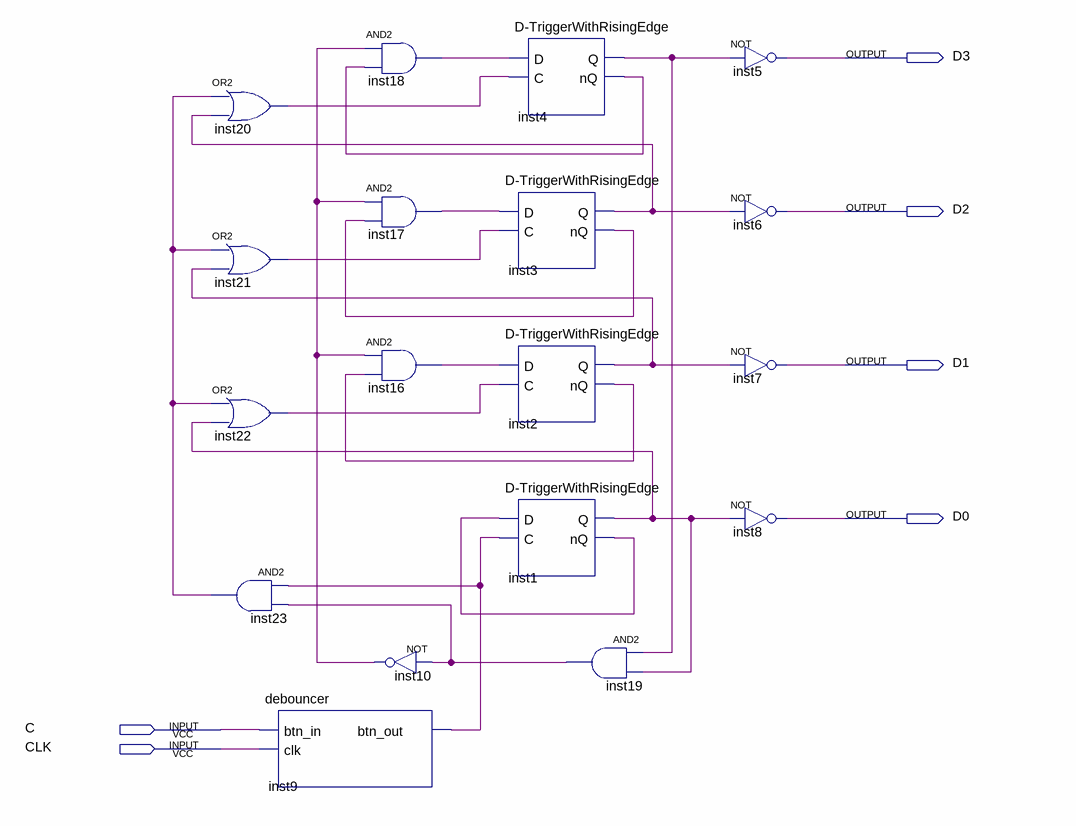
[diagram p0: schematic sheet]
// Quartus schematic Trigger.bdf as structural Verilog: 18 symbols, 6 pins
module Trigger (
  input  C,
  input  CLK,
  output D3,
  output D2,
  output D1,
  output D0
);

  wire inst1_nq, inst1_q, inst2_nq, inst2_q, inst3_nq, inst3_q, inst4_nq, inst4_q, inst9_btn_out, inst10_out,
       inst16_out, inst17_out, inst18_out, inst19_out, inst20_out, inst21_out, inst22_out, inst23_out;

  or inst20 (inst20_out, inst23_out, inst3_q);
  or inst21 (inst21_out, inst23_out, inst2_q);
  or inst22 (inst22_out, inst23_out, inst1_q);
  and inst23 (inst23_out, inst9_btn_out, inst19_out);
  debouncer inst9 (.btn_in(C), .clk(CLK), .btn_out(inst9_btn_out));
  and inst18 (inst18_out, inst10_out, inst4_nq);
  and inst17 (inst17_out, inst10_out, inst3_nq);
  and inst16 (inst16_out, inst10_out, inst2_nq);
  not inst10 (inst10_out, inst19_out);
  \D-TriggerWithRisingEdge  inst4 (.D(inst18_out), .C(inst20_out), .Q(inst4_q), .nQ(inst4_nq));
  \D-TriggerWithRisingEdge  inst3 (.D(inst17_out), .C(inst21_out), .Q(inst3_q), .nQ(inst3_nq));
  \D-TriggerWithRisingEdge  inst2 (.D(inst16_out), .C(inst22_out), .Q(inst2_q), .nQ(inst2_nq));
  \D-TriggerWithRisingEdge  inst1 (.D(inst1_nq), .C(inst9_btn_out), .Q(inst1_q), .nQ(inst1_nq));
  and inst19 (inst19_out, inst4_q, inst1_q);
  not inst5 (D3, inst4_q);
  not inst6 (D2, inst3_q);
  not inst7 (D1, inst2_q);
  not inst8 (D0, inst1_q);
endmodule
